# EAGLE design cktoAlimentacion (EAGLE 9.0.1)
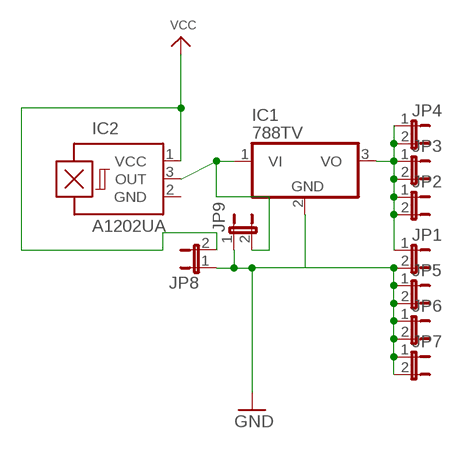
[diagram p0: schematic, sheet 1]

## Parts
IC1  788TV  [TO220V]
IC2  A1202UA  [SIP3-UA]
JP1  JP1E  [JP1]
JP2  JP1E  [JP1]
JP3  JP1E  [JP1]
JP4  JP1E  [JP1]
JP5  JP1E  [JP1]
JP6  JP1E  [JP1]
JP7  JP1E  [JP1]
JP8  JP1E  [JP1]
JP9  JP1E  [JP1]

## Nets
GND: IC1.2(GND) JP1.2 JP5.1 JP5.2 JP6.1 JP6.2 JP7.1 JP7.2 JP8.1 JP9.1
N$2: IC1.1(VI) IC2.3(OUT) JP9.2
N$3: IC1.3(VO) JP1.1 JP2.1 JP2.2 JP3.1 JP3.2 JP4.1 JP4.2
VCC: IC2.1(VCC) JP8.2

## Power pins joined to a net without a drawn wire
GND: IC2.2(GND)

## Library data of the parts
IC1 = linear:78*: Positive VOLTAGE REGULATOR Source: http://cache.national.com/ds/LM/LM78L05.pdf http://www.fairchildsemi.com/ds/LM/LM7805.pdf
IC2 = allegro:A12*?: Hall-effect bipolar switch Source: http://www.allegromicro.com/en/Products/Part_Numbers/1202/1202.pdf; OC_FARNELL: unknown; OC_NEWARK: unknown
JP1-JP9 = jumper:JP1E: JUMPER

## Board
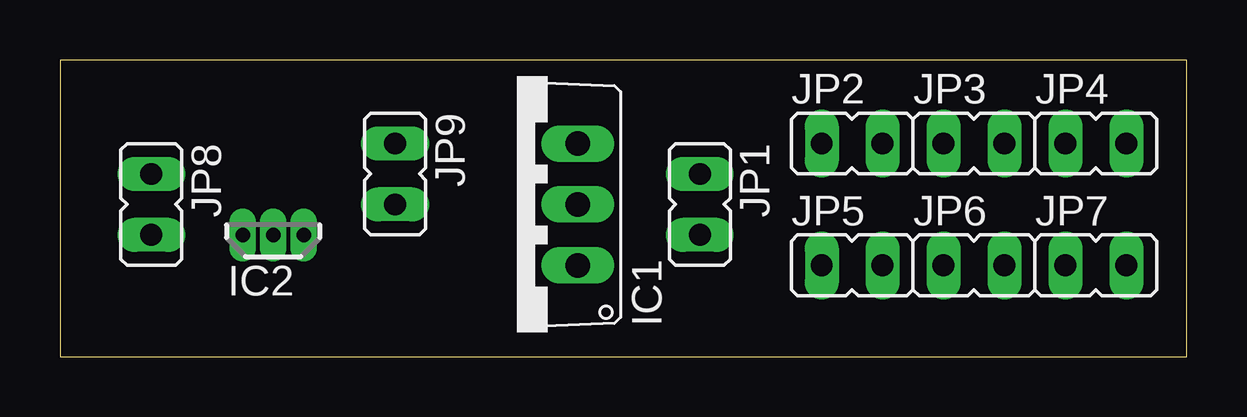
[diagram p1: board, top side]
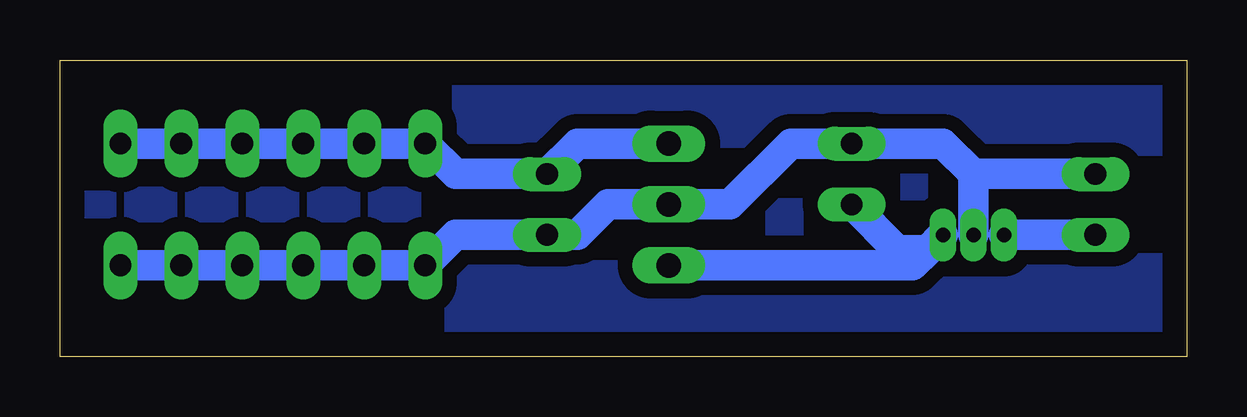
[diagram p2: board, bottom side, seen from below]

Size 46.97 x 12.37 mm. Coordinates in mm from the lower left corner, seen from the top.
Outline: 0,0 46.97,0 46.97,12.37 0,12.37 0,0
Copper layers (1*16): Top 0.035mm / dielectric 1.5mm / Bottom 0.035mm
Design rules "default": minimum track width 6mil, minimum drill 0.35mm, track to track 6mil, track to pad 6mil, pad to pad 6mil, via to via 6mil, smd to smd 6mil, copper to edge 40mil, drill to drill 6mil, minimum pad ring 10mil, minimum via ring 8mil, stop-mask expansion 4mil, vias tented up to drill 0mil, thermal gap 10mil

### Footprints (pad centres in the part's own frame; a part is rotated, then mirrored left to right if it is on the bottom)
TO220V = drill 1.016 long: 1 -2.54,-2.54; 2 0,-2.54; 3 2.54,-2.54
SIP3-UA = drill 0.6 pad 0.7 long: 1 -1.27,0; 2 0,0; 3 1.27,0
JP1 = drill 0.914 long: 1 0,-1.27; 2 0,1.27

### Placement (x,y rotation side)
IC1  19.05,6.35 90 top
IC2  8.89,5.08 0 top
JP1  26.67,6.35 180 top
JP2  33.02,8.89 270 top
JP3  38.1,8.89 270 top
JP4  43.18,8.89 270 top
JP5  33.02,3.81 270 top
JP6  38.1,3.81 270 top
JP7  43.18,3.81 270 top
JP8  3.81,6.35 180 top
JP9  13.97,7.62 180 top

### Tracks (layer width: path | path; a pad name or v marks a point on that pad's centre or on a via)
GND
  Bottom 1.27: JP7.2 JP7.1 JP6.2 JP6.1 JP5.2 JP5.1 30.48,5.08 JP1.2 25.4,5.08 24.13,6.35 IC1.2 19.05,6.35 16.51,8.89 JP9.1 10.16,8.89 8.89,7.62 | IC2.2 8.89,7.62 | JP8.1 8.89,7.62
N$1
  pour Bottom (isolate 0.61): 0,12.7 0,0 46.99,0 46.99,12.7
N$2
  Bottom 1.27: IC2.3 10.79,4.45 | 10.79,4.45 11.43,3.81 IC1.1 | 10.79,4.45 12.06,4.45 JP9.2
N$3
  Bottom 1.27: JP4.2 JP4.1 JP3.2 JP3.1 JP2.2 JP2.1 30.48,7.62 JP1.1 25.4,8.89 IC1.3
VCC
  Bottom 1.27: IC2.1 JP8.2